# EAGLE schematic bms_master_V01 (EAGLE 7.2.0), part 2 of 2
## Sheet 9 of 9
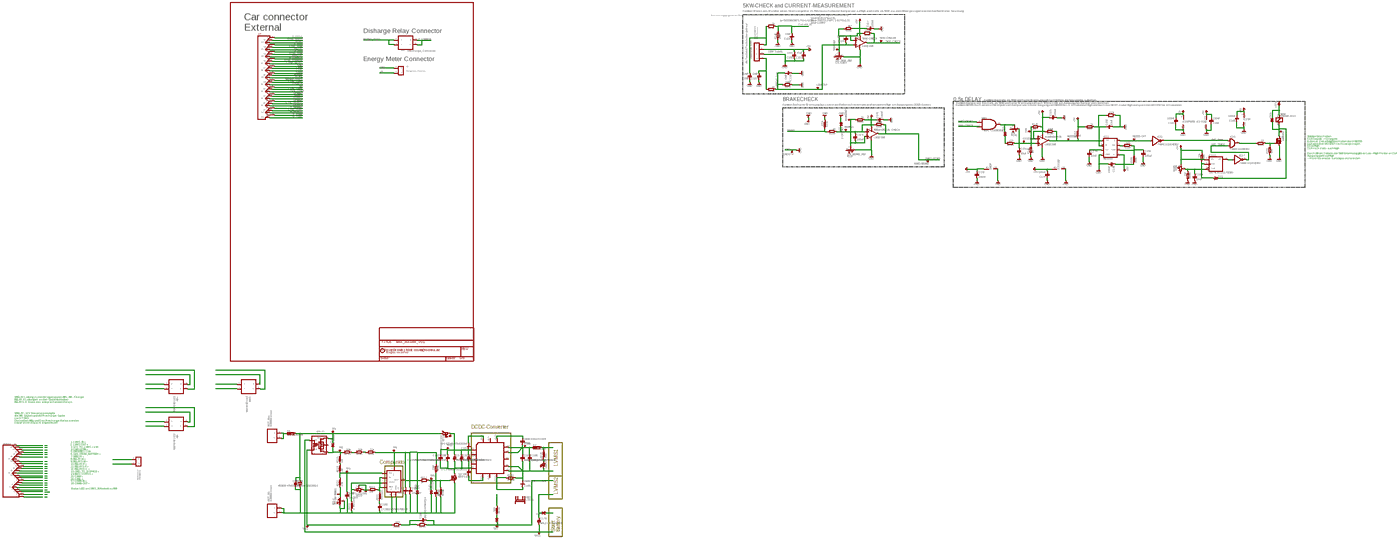
[diagram p8: schematic, sheet 9, overview]
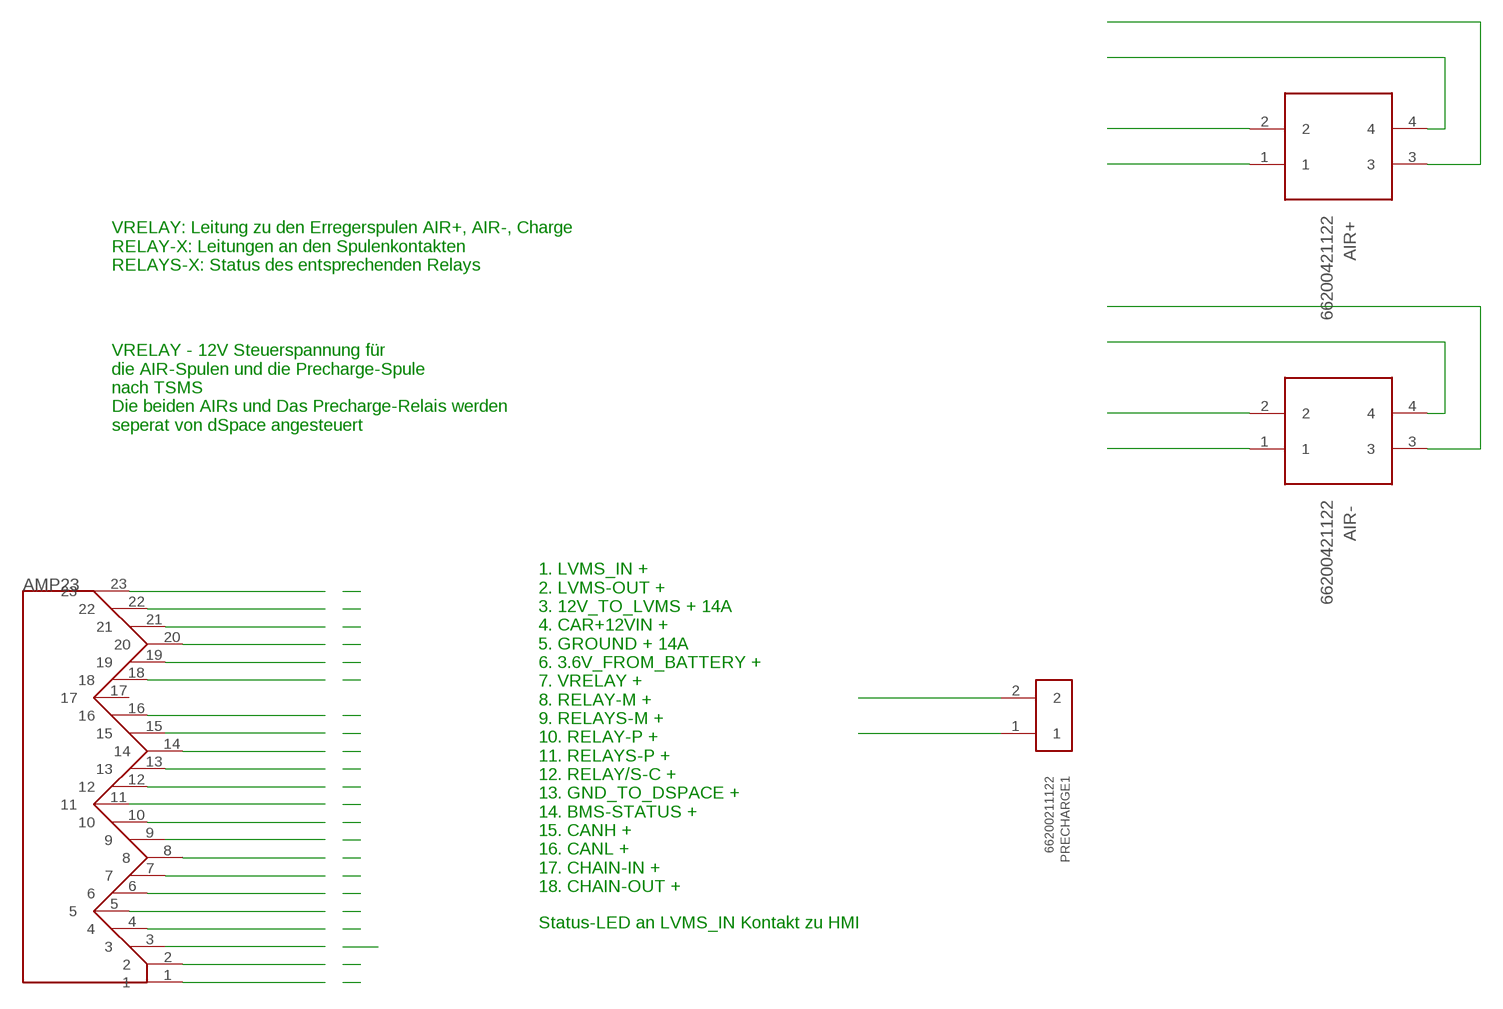
[diagram p9: schematic, sheet 9, part 1 of 5]
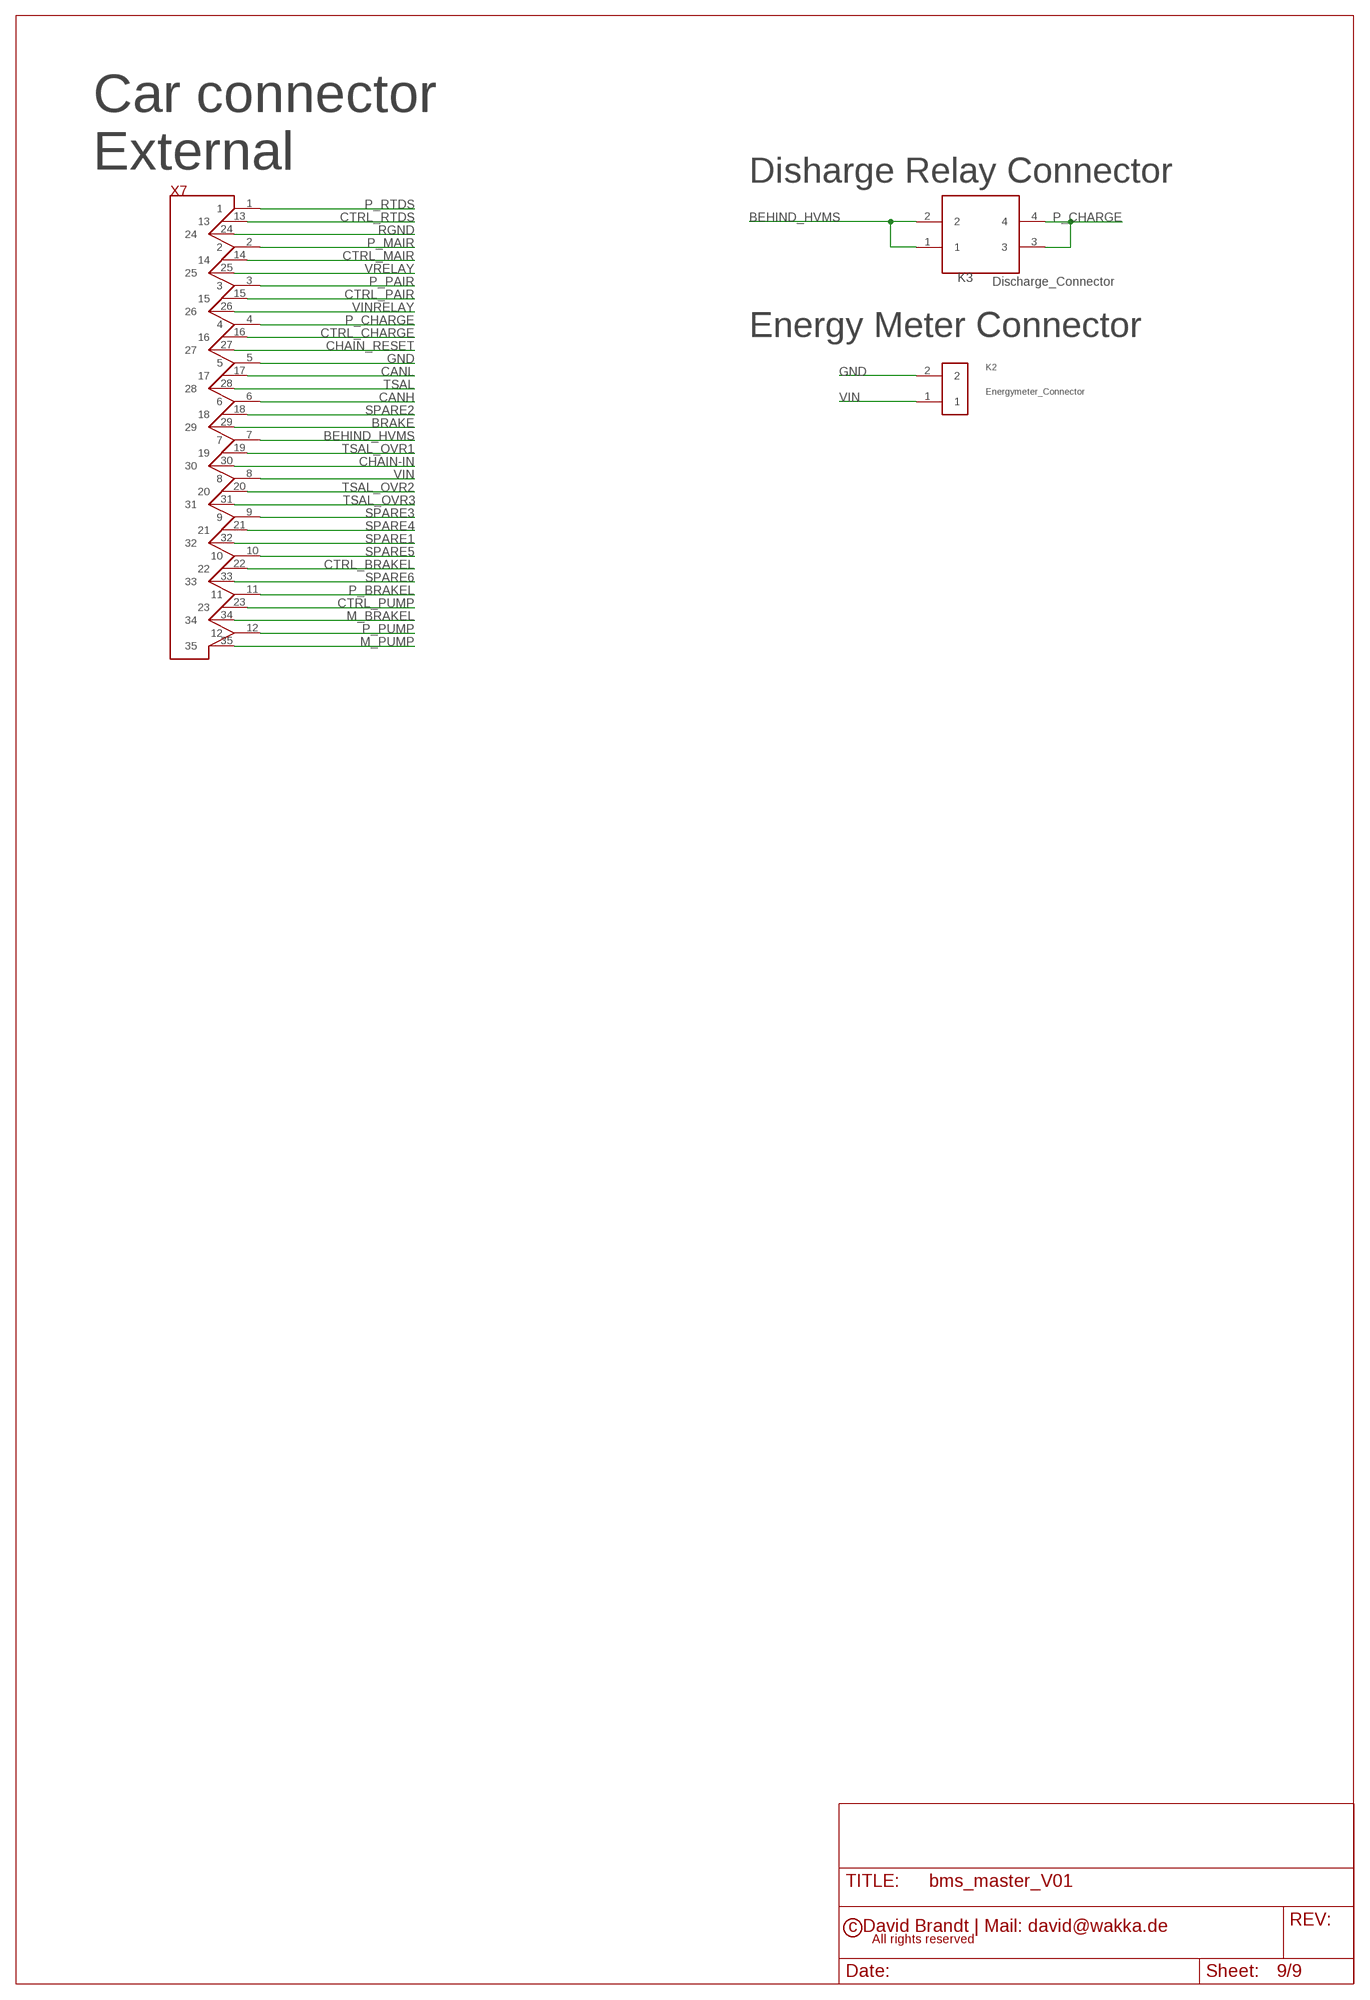
[diagram p10: schematic, sheet 9, part 2 of 5]
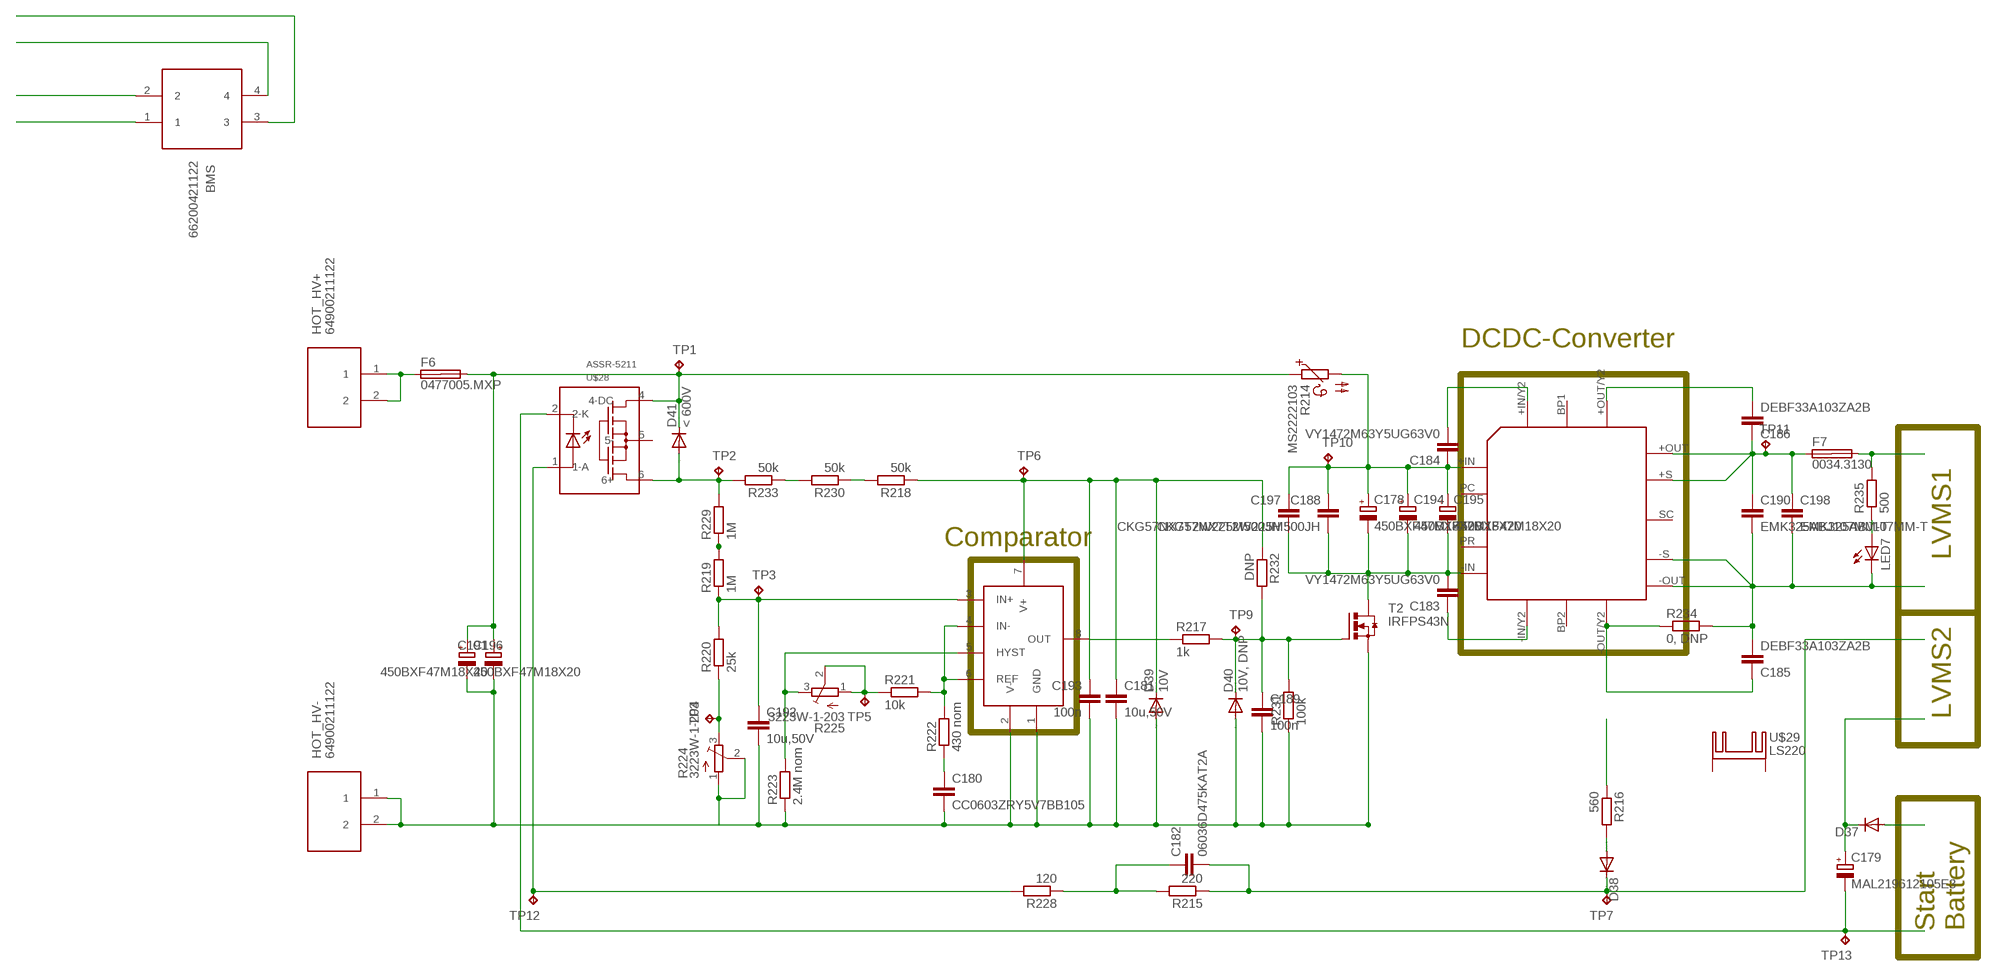
[diagram p11: schematic, sheet 9, part 3 of 5]
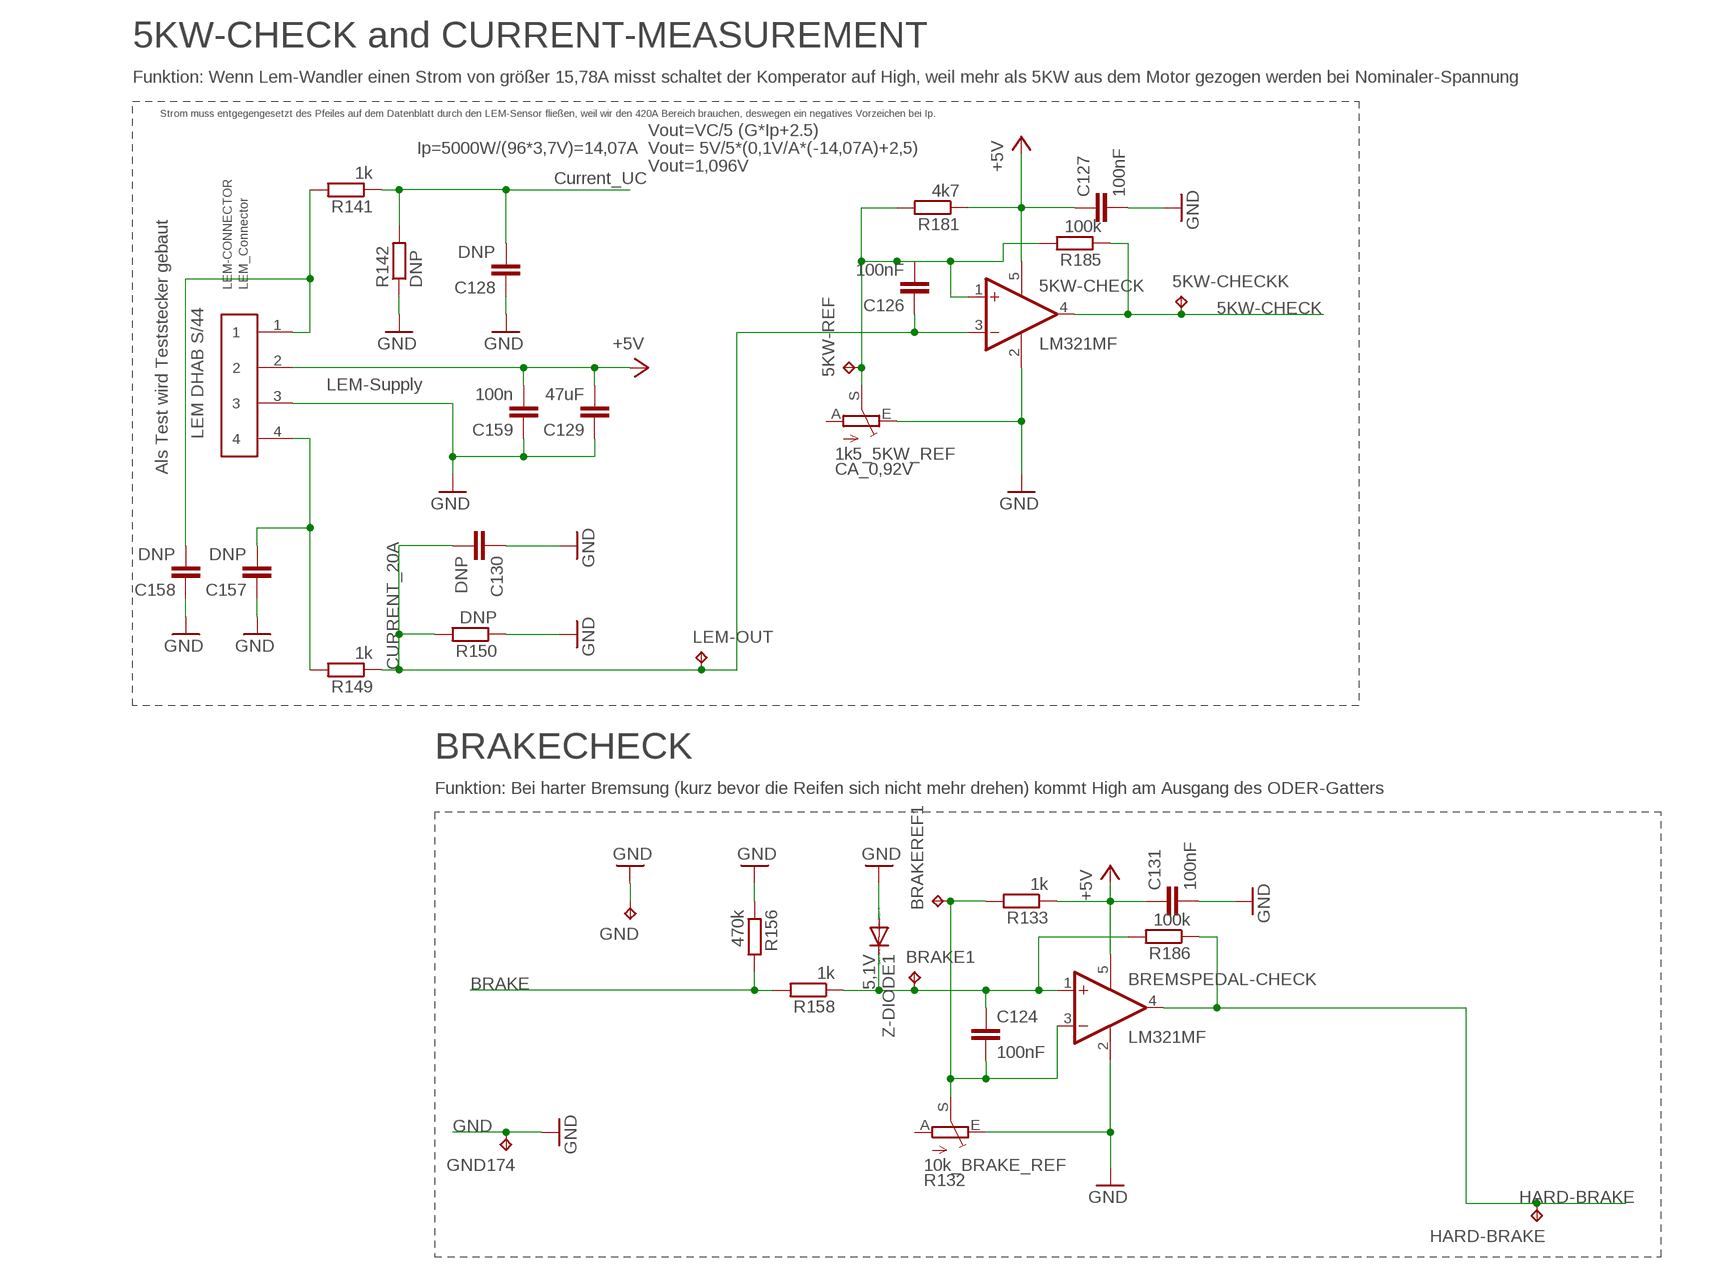
[diagram p12: schematic, sheet 9, part 4 of 5]
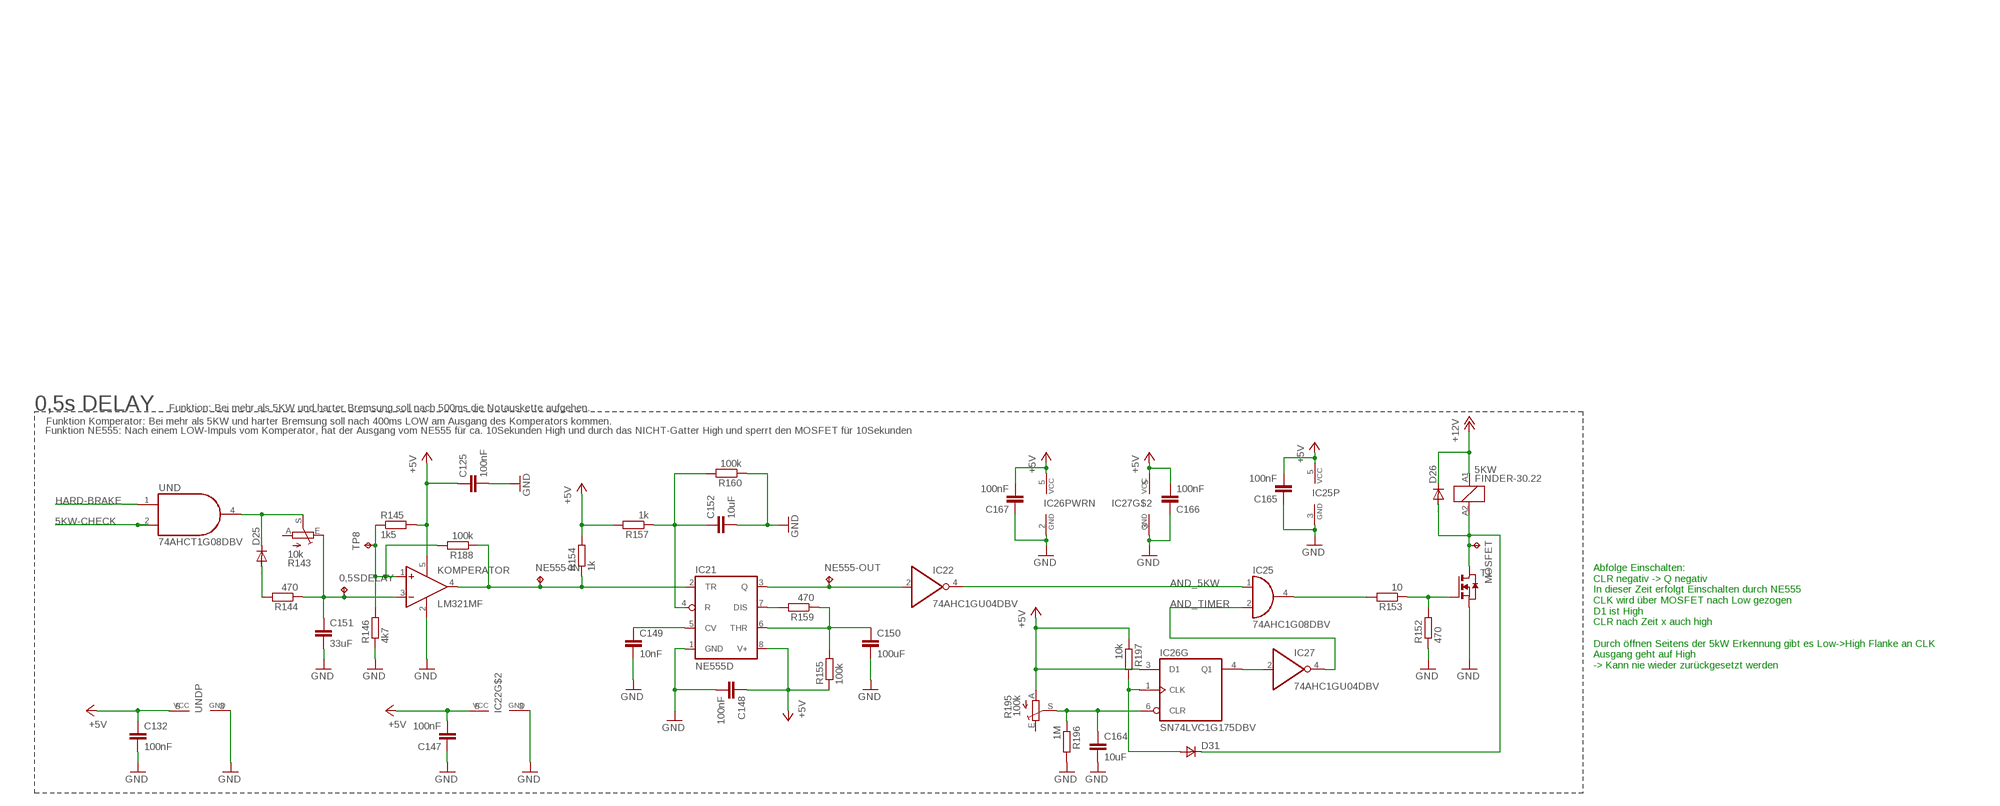
[diagram p13: schematic, sheet 9, part 5 of 5]

### Parts
0,5SDELAY  0.5s_Delay  TPB1,27  [B1,27]
5KW  FINDER-30.22  [FINDER-30.22]
5KW-CHECK  LM321MF  [SOT23-5]
5KW-CHECKK  5KW_Check  TPB1,27  [B1,27]
5KW-REF  5KW_REF  TPB1,27  [B1,27]
AIR+  66200421122  [66200421122]
AIR-  66200421122  [66200421122]
BMS  66200421122  [66200421122]
BRAKE1  BRAKE  TPB1,27  [B1,27]
BRAKEREF1  BRAKE_REF  TPB1,27  [B1,27]
BREMSPEDAL-CHECK  LM321MF  [SOT23-5]
C124  100nF  C-EUC0603  [C0603]
C125  100nF  C-EUC0603  [C0603]
C126  100nF  C-EUC0603  [C0603]
C127  100nF  C-EUC0603  [C0603]
C128  DNP  C-EUC0603  [C0603]
C129  47uF  C-EUC1206  [C1206]
C130  DNP  C-EUC0603  [C0603]
C131  100nF  C-EUC0603  [C0603]
C132  100nF  C-EUC0603  [C0603]
C147  100nF  C-EUC0603  [C0603]
C148  100nF  C-EUC0603  [C0603]
C149  10nF  C-EUC0603  [C0603]
C150  100uF  C-EUC1206K  [C1206K]
C151  33uF  C-EUC1206  [C1206]
C152  10uF  C-EUC0603  [C0603]
C157  DNP  C-EUC0603  [C0603]
C158  DNP  C-EUC0603  [C0603]
C159  100n  C-EUC0603  [C0603]
C164  10uF  C-EUC1206K  [C1206K]
C165  100nF  C-EUC0603  [C0603]
C166  100nF  C-EUC0603  [C0603]
C167  100nF  C-EUC0603  [C0603]
C178  450BXF47M18X20  CPOL-EUE7.5-18  [E7,5-18]
C179  MAL219612105E3  CPOL-EUE5-13  [E5-13]
C180  CC0603ZRY5V7BB105  C-EUC0603  [C0603]
C181  10u,50V  C-EUC1206  [C1206]
C182  06036D475KAT2A  C-EUC0603  [C0603]
C183  VY1472M63Y5UG63V0  CYYC10B5  [YC10B5]
C184  VY1472M63Y5UG63V0  CYYC10B5  [YC10B5]
C185  DEBF33A103ZA2B  C-EU050-040X10  [C050-040X10]
C186  DEBF33A103ZA2B  C-EU050-040X10  [C050-040X10]
C188  CKG57NX7T2W225M500JH  C-EUC2220K  [C2220K]
C189  100n  C-EUC1206  [C1206]
C190  EMK325ABJ107MM-T  C-EUC1210  [C1210]
C191  450BXF47M18X20  CPOL-EUE7.5-18  [E7,5-18]
C192  10u,50V  C-EUC1206  [C1206]
C193  100n  C-EUC1206  [C1206]
C194  450BXF47M18X20  CPOL-EUE7.5-18  [E7,5-18]
C195  450BXF47M18X20  CPOL-EUE7.5-18  [E7,5-18]
C196  450BXF47M18X20  CPOL-EUE7.5-18  [E7,5-18]
C197  CKG57NX7T2W225M500JH  C-EUC2220K  [C2220K]
C198  EMK325ABJ107MM-T  C-EUC1210  [C1210]
CA_0,92V  1k5_5KW_REF  TRIM_EU-S64W  [S64W]
D25  DIODE-SOD323-R  [SOD323-R]
D26  DIODE-SOD323-R  [SOD323-R]
D31  DSOD323  [SOD323]
D37  DIODE-SOD323-W  [SOD323-W]
D38  DIODE-SOD123  [SOD123]
D39  10V  DIODE-DO-214AC  [DO-214AC]
D40  10V, DNP  DIODE-DO-214AC  [DO-214AC]
D41  < 600V  DIODE-DO-214AC  [DO-214AC]
F6  0477005.MXP  SHK20L  [SHK20L]
F7  0034.3130  SHK20L  [SHK20L]
GND  GND  TPB1,27  [B1,27]
GND174  GND  TPB1,27  [B1,27]
HARD-BRAKE  HARD_BRAKE  TPB1,27  [B1,27]
HOT_HV+  64900211122  [64900211122]
HOT_HV-  64900211122  [64900211122]
IC21  NE555D  [SO08]
IC22  74AHC1GU04DBV  [SOT23-5]
IC25  74AHC1G08DBV  [SOT23-5]
IC26  SN74LVC1G175DBV  [SOT23-6]
IC27  74AHC1GU04DBV  [SOT23-5]
IC31  LTC1440  [SO08]
K2  Energymeter_Connector  66200211122  [66200211122]
K3  Discharge_Connector  66200421122  [66200421122]
KOMPERATOR  LM321MF  [SOT23-5]
LED7  LEDCHIPLED_1206  [CHIPLED_1206]
LEM-CONNECTOR  LEM_Connector  66200411122  [66200411122]
LEM-OUT  LEMC_OUT  TPB1,27  [B1,27]
MOSFET  MOSFET  TPB1,27  [B1,27]
NE555-IN  NE555_IN  TPB1,27  [B1,27]
NE555-OUT  NE555_OUT  TPB1,27  [B1,27]
PRECHARGE1  66200211122  [66200211122]
R132  10k_BRAKE_REF  TRIM_EU-S64W  [S64W]
R133  1k  R-EU_R0603  [R0603]
R141  1k  R-EU_R0603  [R0603]
R142  DNP  R-EU_R0603  [R0603]
R143  10k  TRIM_EU-S64W  [S64W]
R144  470  R-EU_R0603  [R0603]
R145  1k5  R-EU_R0603  [R0603]
R146  4k7  R-EU_R0603  [R0603]
R149  1k  R-EU_R0603  [R0603]
R150  DNP  R-EU_R0603  [R0603]
R152  470  R-EU_R0603  [R0603]
R153  10  R-EU_R0603  [R0603]
R154  1k  R-EU_R0603  [R0603]
R155  100k  R-EU_R0603  [R0603]
R156  470k  R-EU_R0603  [R0603]
R157  1k  R-EU_R0603  [R0603]
R158  1k  R-EU_R0603  [R0603]
R159  470  R-EU_R0603  [R0603]
R160  100k  R-EU_R0603  [R0603]
R181  4k7  R-EU_R0603  [R0603]
R185  100k  R-EU_R0603  [R0603]
R186  100k  R-EU_R0603  [R0603]
R188  100k  R-EU_R0603  [R0603]
R195  100k  TRIM_EU-S64W  [S64W]
R196  1M  R-EU_R0603  [R0603]
R197  10k  R-EU_R0603  [R0603]
R214  MS2222103  [MS2222103]
R215  220  R-EU_R0603  [R0603]
R216  560  R-EU_R0603  [R0603]
R217  1k  R-EU_R1206  [R1206]
R218  50k  R-EU_WSC2515  [WSC2515]
R219  1M  R-EU_WSC2515  [WSC2515]
R220  25k  R-EU_R1206  [R1206]
R221  10k  R-EU_R0603  [R0603]
R222  430 nom  R-EU_R0603  [R0603]
R223  2.4M nom  R-EU_R0603  [R0603]
R224  3223W-1-203  TRIM_EU-3223W  [3223W]
R225  3223W-1-203  TRIM_EU-3223W  [3223W]
R228  120  R-EU_R0603  [R0603]
R229  1M  R-EU_WSC2515  [WSC2515]
R230  50k  R-EU_WSC2515  [WSC2515]
R231  100k  R-EU_R1206  [R1206]
R232  DNP  R-EU_R1206  [R1206]
R233  50k  R-EU_WSC2515  [WSC2515]
R234  0, DNP  R-EU_R1210  [R1210]
R235  500  R-EU_R1206W  [R1206W]
T1  NMOSSOT23  [SOT-23]
T2  IRFPS43N  [TO247BV]
TP1  TPB2,54  [B2,54]
TP2  TPB2,54  [B2,54]
TP3  TPB2,54  [B2,54]
TP4  TPB2,54  [B2,54]
TP5  TPB2,54  [B2,54]
TP6  TPB2,54  [B2,54]
TP7  TPB2,54  [B2,54]
TP8  TPB1,27  [B1,27]
TP9  TPB2,54  [B2,54]
TP10  TPB2,54  [B2,54]
TP11  TPB2,54  [B2,54]
TP12  TPB2,54  [B2,54]
TP13  TPB2,54  [B2,54]
U$26  AMSEAL23RW  [AMPSEAL23RW]
U$27  VICORPOWER_V375B12C300BL2  [VICORPOWER_V375B12C300BL2]
U$28  ASSR-5211  [DIL06]
U$29  LS220  [LS220]
UND  74AHCT1G08DBV  [SOT23-5]
X7  AMPSEAL_35  [AMPSEAL_776231-1]
Z-DIODE1  5,1V  DIODE-SOD323-R  [SOD323-R]

### Nets
0,5SDELAY: 0,5SDELAY.TP C151.1 KOMPERATOR.3(-IN) R143.E R144.1
3.6V_FROM_BATTERY: D37.A U$26.10
5KW-CHECK: 5KW-CHECK.4(OUT) 5KW-CHECKK.TP R185.1 UND.2(I1)
5KWOP-: 5KW-CHECK.1(+IN) 5KW-REF.TP C126.2 CA_0,92V.S R181.2 R185.2
10V: C181.1 C193.1 D39.C IC31.7(V+) R218.1 R232.1 TP6.TP
12V_TO_LVMS: F7.2A R235.2 U$26.3 U$26.11 U$26.18
+5V: 5KW-CHECK.5(V+) BREMSPEDAL-CHECK.5(V+) C125.1 C127.1 C129.2 C131.1 C132.1 C147.2 C148.1 C159.2 C165.2 C166.2 C167.2 IC21.8(V+) IC22.5(VCC) IC25.5(VCC) IC26.3(G:D1) IC26.5(PWRN:VCC) IC27.5(VCC) KOMPERATOR.5(V+) LEM-CONNECTOR.2 R133.1 R145.2 R154.2 R155.1 R157.2 R181.1 R195.A R197.1 UND.5(VCC) ; also sheet 2,6,7
AND_5KW: IC22.4(O) IC25.1(I0)
AND_TIMER: IC25.2(I1) IC27.4(O)
BEHIND_HVMS: K3.1 K3.2 X7.7
BMS_STATUS: U$26.13
BRAKE: R156.2 R158.2 X7.29
BRAKE1OP+: BRAKE1.TP BREMSPEDAL-CHECK.1(+IN) C124.1 R158.1 R186.2 Z-DIODE1.C
BRAKE1OP-: BRAKEREF1.TP BREMSPEDAL-CHECK.3(-IN) C124.2 R132.S R133.2
CANH: X7.6
CANH1: BMS.1 U$26.12
CANL: X7.17
CANL1: BMS.2 U$26.4
CAR+12VIN: BMS.4 R216.1 U$26.6
CHAIN-IN: X7.30
CHAIN-IN1: U$26.7
CHAIN-OUT1: U$26.8
CHAIN_RESET: X7.27
CTRL_BRAKEL: X7.22 ; also sheet 5,8
CTRL_CHARGE: X7.16
CTRL_MAIR: X7.14
CTRL_PAIR: X7.15
CTRL_PUMP: X7.23 ; also sheet 5,8
CTRL_RTDS: X7.13 ; also sheet 5,8
CURRENT_20A: 5KW-CHECK.3(-IN) C126.1 C130.2 LEM-OUT.TP R149.1 R150.2
CURRENT_UC: C128.2 R141.1 R142.2
DCDC+: C178.+ C184.1 C188.1 C194.+ C195.+ C197.1 R214.2 TP10.TP U$27.+IN(1_+IN)
DCDC-: C178.- C183.2 C188.2 C194.- C195.- C197.2 T2.D(D1) U$27.-IN(4_-IN)
DCDCOUT+: C186.1 C190.1 C198.1 F7.1A TP11.TP U$27.+OUT(9_+OUT) U$27.+S(8_+S)
DELAYOP+: KOMPERATOR.1(+IN) R145.1 R146.2 R188.2 TP8.TP
DISCHARGE: IC21.7(DIS) R159.2
GATE: R152.2 R153.1 T1.3(G)
GATE1: C189.1 D40.C R217.2 R231.2 R232.2 T2.G(G1) TP9.TP
GND: 5KW-CHECK.2(V-) BREMSPEDAL-CHECK.2(V-) C125.2 C127.2 C128.1 C129.1 C130.1 C131.2 C132.2 C147.1 C148.2 C149.2 C150.2 C151.2 C152.2 C157.1 C158.1 C159.1 C164.2 C165.1 C166.1 C167.1 CA_0,92V.E GND174.TP GND.TP IC21.1(GND) IC22.3(GND) IC25.3(GND) IC26.2(PWRN:GND) IC27.3(GND) K2.2 KOMPERATOR.2(V-) LEM-CONNECTOR.3 R132.E R142.1 R146.1 R150.1 R152.1 R156.1 R160.1 R196.2 T1.2(S) UND.3(GND) X7.5 Z-DIODE1.A ; also sheet 2,3,4,5,6,7,8
GND_TO_DSPACE: BMS.3 U$26.5
GROUND: AIR+.3 AIR-.3 C179.- C185.2 C190.2 C198.2 LED7.C R234.2 TP13.TP U$26.1 U$26.9 U$26.16 U$27.-OUT(5_-OUT) U$27.-S(6_-S) U$28.2(2-K)
HARD-BRAKE: BREMSPEDAL-CHECK.4(OUT) HARD-BRAKE.TP R186.1 UND.1(I0)
HOT_BF_VH+: F6.1A HOT_HV+.1 HOT_HV+.2
HV+: C191.+ C196.+ D41.C F6.2A R214.1 TP1.TP U$28.4(4-DC)
HV+MR: R219.2 R229.1
HV+SW: D41.A R229.2 R233.2 TP2.TP U$28.6(6+)
HV+SW1: R230.2 R233.1
HV+SW2: R218.2 R230.1
HV-1: C180.2 C181.2 C189.2 C191.- C192.2 C193.2 C196.- D39.A D40.A HOT_HV-.1 HOT_HV-.2 IC31.1(GND) IC31.2(V-) R223.1 R224.1(A) R224.2(S) R231.1 T2.S(S1)
HYST: IC31.5(HYST) R223.2 R225.3(E)
IN+: C192.1 IC31.3(IN+) R219.1 R220.2 TP3.TP
LVMS_IN: C182.2 D38.C R215.1 TP7.TP U$26.19
LVMS_OUT: C179.+ D37.C U$26.2
M_BRAKEL: X7.34
M_PUMP: X7.35
N$69: D25.A R144.2
N$104: C157.2 LEM-CONNECTOR.4 R149.2
N$105: C158.2 LEM-CONNECTOR.1 R141.2
N$110: IC26.4(G:Q1) IC27.2(I)
N$111: D31.2(A) IC26.1(G:CLK) R197.2
N$113: D38.A R216.2
N$114: R220.1 R224.3(E) TP4.TP
N$115: C182.1 R215.2 R228.1
N$116: LED7.A R235.1
NE555-CV: C149.1 IC21.5(CV)
NE555-IN: IC21.2(TR) KOMPERATOR.4(OUT) NE555-IN.TP R154.1 R188.1
NE555-OUT: IC21.3(Q) IC22.2(I) NE555-OUT.TP
NE555-RESET: C152.1 IC21.4(R) R157.1 R160.2
NOT-OUT: IC25.4(O) R153.2
OPTOA: R228.2 TP12.TP U$28.1(1-A)
OUT: IC31.8(OUT) R217.1
P_BRAKEL: X7.11
P_CHARGE: K3.3 K3.4 X7.4
P_MAIR: X7.2
P_PAIR: X7.3
P_PUMP: X7.12
P_RTDS: X7.1
REF: IC31.4(IN-) IC31.6(REF) R221.2 R222.2
REFF: C180.1 R222.1
REFR: R221.1 R225.1(A) R225.2(S) TP5.TP
RELAY-M: AIR-.1 U$26.21
RELAY-P: AIR+.2 U$26.23
RELAY/S-C: PRECHARGE1.2 U$26.15
RELAYS-M: AIR-.4 U$26.20
RELAYS-P: AIR+.4 U$26.14
RGND: X7.24
SL: C164.1 IC26.6(G:CLR) R195.S R196.1
SNUBHV+: C184.2 U$27.+IN/Y2
SNUBHV-: C183.1 U$27.-IN/Y2
SNUBLV+: C186.2 U$27.+OUT/Y2
SNUBLV-: C185.1 R234.1 U$27.-OUT/Y2
SOURCE: 5KW.A2 D26.A D31.1(C) MOSFET.TP T1.1(D)
SPARE1: X7.32
SPARE2: X7.18
SPARE3: X7.9
SPARE4: X7.21
SPARE5: X7.10
SPARE6: X7.33
THRESHOLD: C150.1 IC21.6(THR) R155.2 R159.1
TSAL: X7.28
TSAL_OVR1: X7.19
TSAL_OVR2: X7.20
TSAL_OVR3: X7.31
UND-OUT: D25.C R143.S UND.4(O)
VIN: 5KW.A1 D26.C K2.1 X7.8 ; supply symbol labelled +12V ; also sheet 2
VINRELAY: X7.26
VRELAY: X7.25
VRELAY1: AIR+.1 AIR-.2 PRECHARGE1.1 U$26.22
Unconnected: 5KW.11(-1:P) 5KW.12(-1:O) 5KW.14(-1:S) 5KW.21(-2:P) 5KW.22(-2:O) 5KW.24(-2:S) CA_0,92V.A F6.1B F6.2B F7.1B F7.2B R132.A R143.A R195.E U$26.17 U$27.BP1 U$27.BP2 U$27.PC(2_PC) U$27.PR(3_PR) U$27.SC(7_SC) U$28.5(5-) U$29.P$1(K) U$29.P$2(K)

### Notes on the sheet
- 5KW-CHECK and CURRENT-MEASUREMENT
- Funktion: Wenn Lem-Wandler einen Strom von größer 15,78A misst schaltet der Komperator auf High, weil mehr als 5KW aus dem Motor gezogen werden bei Nominaler-Spannung
- Strom muss entgegengesetzt des Pfeiles auf dem Datenblatt durch den LEM-Sensor fließen, weil wir den 420A Bereich brauchen, deswegen ein negatives Vorzeichen bei Ip.
- Vout=VC/5 (G*Ip+2.5)
- Ip=5000W/(96*3,7V)=14,07A | Vout= 5V/5*(0,1V/A*(-14,07A)+2,5)
- Vout=1,096V
- Current_UC
- Car connector
  External
- Disharge Relay Connector
- LEM-Supply
- LEM DHAB S/44
- Energy Meter Connector
- Als Test wird Teststecker gebaut
- CURRENT_20A
- BRAKECHECK | 0,5s DELAY | Funktion: Bei mehr als 5KW und harter Bremsung soll nach 500ms die Notauskette aufgehen.
- Funktion Komperator: Bei mehr als 5KW und harter Bremsung soll nach 400ms LOW am Ausgang des Komperators kommen.
- Funktion: Bei harter Bremsung (kurz bevor die Reifen sich nicht mehr drehen) kommt High am Ausgang des ODER-Gatters | Funktion NE555: Nach einem LOW-Impuls vom Komperator, hat der Ausgang vom NE555 für ca. 10Sekunden High und durch das NICHT-Gatter High und sperrt den MOSFET für 10Sekunden
- Abfolge Einschalten:
  CLR negativ -> Q negativ
  In dieser Zeit erfolgt Einschalten durch NE555
  CLK wird über MOSFET nach Low gezogen
  D1 ist High
  CLR nach Zeit x auch high
  
  Durch öffnen Seitens der 5kW Erkennung gibt es Low->High Flanke an CLK
  Ausgang geht auf High
  -> Kann nie wieder zurückgesetzt werden
- VRELAY: Leitung zu den Erregerspulen AIR+, AIR-, Charge
  RELAY-X: Leitungen an den Spulenkontakten
  RELAYS-X: Status des entsprechenden Relays
- VRELAY - 12V Steuerspannung für 
  die AIR-Spulen und die Precharge-Spule
  nach TSMS
  Die beiden AIRs und Das Precharge-Relais werden
  seperat von dSpace angesteuert
- DCDC-Converter
- Comparator
- LVMS1
- 1. LVMS_IN +
  2. LVMS-OUT +
  3. 12V_TO_LVMS + 14A
  4. CAR+12VIN +
  5. GROUND + 14A
  6. 3.6V_FROM_BATTERY +
  7. VRELAY +
  8. RELAY-M +
  9. RELAYS-M +
  10. RELAY-P +
  11. RELAYS-P +
  12. RELAY/S-C +
  13. GND_TO_DSPACE +
  14. BMS-STATUS +
  15. CANH +
  16. CANL +
  17. CHAIN-IN +
  18. CHAIN-OUT +
- Status-LED an LVMS_IN Kontakt zu HMI
- LVMS2
- Start
  Battery

## Library data of the parts
0,5SDELAY 5KW-CHECKK 5KW-REF BRAKE1 BRAKEREF1 GND GND174 HARD-BRAKE LEM-OUT MOSFET NE555-IN NE555-OUT TP1-TP13 = testpad:TP: Test pad
5KW K_BMS K_BSPD K_IMD = relay:FINDER-30.22: SUBMINIATURE DIL-RELAIS FINDER 30.22.9.024.0000 Kontakt max. AC - 125V Distributor: Farnell Bestell Nr.: 1217371 Source: http://www.farnell.com/datasheets/87634.pdf; OC_FARNELL: unknown; OC_NEWARK: unknown
5KW-CHECK BREMSPEDAL-CHECK KOMPERATOR = linear:LM321?*: Low Power Single Op Amp Source: http://cache.national.com/ds/LM/LM321.pdf
AIR+ AIR- BMS K3 = Wuerth_Elektronik_eiCan_08_Micro_Power_Connectors:66200421122: WR-MPC3 3.00mm Male Dual Row Vertical Header, 4 Pins
B1 = microbuilder:SWITCH_TACT_SMT: SMT Tact Switches 6x6mm - Digikey: P12940SCT-ND KMR2 (4.6x2.8mm) - Digikey: 401-1426-1-ND EVQ-PQHB55 - Light Touch, 160GF (4.5x4.5mm) - Digikey: P8090SCT-ND
BAT1 = SparkFun-Electromechanical:BATTERY: Battery Holders Various common sizes : AA, AAA, 20mm coin cell and 12mm coin cell. 20MM_4LEGS, BATT-10373
C1-C40 C42-C50 C52-C80 C82-C87 C97-C102 C199-C202 C205-C229 = phrenetic:C
C41 C51 C178 C179 C191 C194-C196 C203 C204 = rcl:CPOL-EU: POLARIZED CAPACITOR, European symbol
C81 = resistor:CPOL-EU: POLARIZED CAPACITOR, European symbol
C124-C132 C147-C152 C157-C159 C164-C167 C180-C182 C185 C186 C189 C190 C192 C193 C198 = rcl:C-EU: CAPACITOR, European symbol
C183 C184 = rcl:CY: Y CAPACITOR for power line
C188 C197 = resistor:C-EU: CAPACITOR, European symbol
CA_0,92V R132 R143 R195 R224 R225 R273 = pot:TRIM_EU-: POTENTIOMETER
CN1 = phrenetic:MICROSD: MicroSD/Transflash Card Holder with SPI pinout 3M: 2908-05WB-MG 4UConnector: 19656 Footprint courtesy: Adafruit Industries
D1 D20-D22 D52 D60 D61 D64 D65 = phrenetic:DIODE-: DIODE
D2 D4-D9 D19 D23 D43-D51 D53-D58 D62 D63 = phrenetic:ZENER
D25 D26 D37-D41 DIN Z-DIODE1 = diode:DIODE-: DIODE
D31 = zetex:D: DIODE; MPN: CDSOD323-T05C; OC_FARNELL: 1824860; OC_NEWARK: 79R6078
DCDC1 DCDC2 = phrenetic:DCDC_ISO
F1-F4 F8-F14 = phrenetic:FUSE
F6 F7 = fuse:SHK20L: FUSE HOLDER 5 x 20 mm, SH contact, SHH1 Schukat, E1073 Buerklin; OC_FARNELL: unknown; OC_NEWARK: unknown
FID1-FID11 = microbuilder:FIDUCIAL: Fiducial Alignment Points Various fiducial points for machine vision alignment.
HOT_HV+ HOT_HV- = Wuerth_Elektronik_eiCan_07_Mini_Power_Connectors:64900211122: WR-MPC4 4.20mm Male Single Row Vertical Header, 2 Pins
IC1 IC7 IC8 = phrenetic:SN65HVDA540
IC2 IC12 IC13 = microbuilder:TEMP_LM75B: LM75B I2C Temperature Sensor The I2C-based LM75B can measure temperature between -55 and 125°C in 0.125°C increments (11-bit resolution). Digikey: 568-4768-1-ND For a 1.8V compatible part, look at the following pin and SW compatible parts: DS75LV - Mouser: 700-DS75LVS, Digikey: (TSSOP8) DS75LVU+-ND (SOIC8) DS75LVS+-ND
IC3 = phrenetic:MPU9250
IC4 = TMS570:TPS65381-Q1
IC5 IC45 = linear:TL331: SINGLE DIFFERENTIAL COMPARATOR Source: Data sheet <http://www.ti.com/lit/ds/symlink/tl331-q1.pdf>
IC6 = TMS570:PCA2129T
IC9 = linear:LM2902: Low power quad operational amplifier Source: Data sgeet <http://www.st.com/internet/com/TECHNICAL_RESOURCES/TECHNICAL_LITERATURE/DATASHEET/CD00000533.pdf>
IC10 IC39 IC41 IC49 IC54 = 74xx-little-de:74*1G04: INVERTER Gate
IC11 = TMS570:TMS570LS3137ZWT
IC16 IC21 IC46 = linear:*555: TIMER
IC17 IC44 = 74xx-little-de:74*1G02: 2-input NOR gate
IC18 = 74xx-eu:74*125: Quad bus BUFFER, 3-state
IC22 IC27 = 74xx-little-de:74*1GU04: Single Unbuffered Inverter
IC25 IC42 IC47 IC48 IC50-IC53 = 74xx-little-de:74*1G08: 2-input AND gate
IC26 = phrenetic:SN74LVC1G175
IC31 = LTC1140:LTC1440
IC32-IC35 = phrenetic:UCC27XXX-Q1
IC36 IC37 IC40 IC43 = 74xx-little-de:74*1G32: 2-input OR gate
IC38 = 74xx-little-de:74*1G79: Single Positive-Edge-Triggered D-Type Flip-Flop Source: Data sheet <http://www.ti.com/lit/ds/symlink/sn74lvc1g79.pdf>
IC123 = phrenetic:VIPER16
JTAG1 = phrenetic:JTAG20
K2 PRECHARGE1 = Wuerth_Elektronik_eiCan_08_Micro_Power_Connectors:66200211122: WR-MPC3 3.00mm Male Single Row Vertical Header, 2 Pins
L1 L7 = EagleLibrary_Wuerth_Elektronik_eiSos_Version_6:WE-PMI: Power Multilayer Inductor WE-PMI - Compact multilayer type - Suitable for applocations with high currents up to 2.5 A - No crosstalk -- DC / DC converters especially at high switching frequencies -- Portable devices like PDA and digital cameras
L2 = SignalCommunications:WE-PD2: SMD-Power Inductors WE-PD2 - Industry standard size - Current capability up to 14 A -- Switching regulators with low operating voltages (computer, laptop, mobile phones, pagers) -- Integrated DC/DC-converter -- Is recommended for the application with switching regulators from National Semiconductor, Linear Technology, Texas Instruments and Fairchild Semiconductor -- Perfectly suitable for switching regulators with extremely high efficiency
L3 = SignalCommunications:WE-PD2_HV: SMD-Power Inductors WE-PD2 HV - Unshielde construction - Designed for 400VDC -- Non-isolated buck or buck-boost converter like Power Integrations LinkSwitch-TN -- Constant current LED driver -- Utility metering -- Filter for power supply; COMPANY-URL: http://we-online.de; CREATED-BY: Christin Otto; CREATED-DATE: August 2013; DATASHEET-URL: http://katalog.we-online.de/de/pbs/WE-PD2_HV?sid=27407868f1#vs_ct:1; MANUFACTURER: Würth Elektronik eiSos GmbH
L4 = PowerMagnetics:WE-CBF: SMD EMI Suppression Ferrite Beads WE-CBF - Excellent anti-EMI properties - Low DC-restistance - Impedances till 3000 ohms - Rated current up to 6 A -- Reliable Ni-Sn electrodes -- Perfect as data lined filter and for uncoupling of distribution voltage <http://katalog.we-online.de/media/images/eisos/FeCBF_pf2.jpg> Details see: http://katalog.we-online.de/en/pbs/WE-CBF updated by Dan Xu 2014-06-19 2014 (C) Würth Elektronik
LED1 LED3 LED5 = phrenetic:LED
LED7 = led:LED: LED OSRAM: - CHIPLED LG R971, LG N971, LY N971, LG Q971, LY Q971, LO R971, LY R971 LH N974, LH R974 LS Q976, LO Q976, LY Q976 LO Q996 - Hyper CHIPLED LW Q18S LB Q993, LB Q99A, LB R99A - SideLED LS A670, LO A670, LY A670, LG A670, LP A670 LB A673, LV A673, LT A673, LW A673 LH A674 LY A675 LS A676, LA A676, LO A676, LY A676, LW A676 LS A679, LY A679, LG A679 - Hyper Micro SIDELED® LS Y876, LA Y876, LO Y876, LY Y876 LT Y87S - SmartLED LW L88C, LW L88S LB L89C, LB L89S, LG L890 LS L89K, LO L89K, LY L89K LS L896, LA L896, LO L896, LY L896 - TOPLED LS T670, LO T670, LY T670, LG T670, LP T670 LSG T670, LSP T670, LSY T670, LOP T670, LYG T670 LG T671, LOG T671, LSG T671 LB T673, LV T673, LT T673, LW T673 LH T674 LS T676, LA T676, LO T676, LY T676, LB T676, LH T676, LSB T676, LW T676 LB T67C, LV T67C, LT T67C, LS T67K, LO T67K, LY T67K, LW E67C LS E67B, LA E67B, LO E67B, LY E67B, LB E67C, LV E67C, LT E67C LW T67C LS T679, LY T679, LG T679 LS T770, LO T770, LY T770, LG T770, LP T770 LB T773, LV T773, LT T773, LW T773 LH T774 LS E675, LA E675, LY E675, LS T675 LS T776, LA T776, LO T776, LY T776, LB T776 LHGB T686 LT T68C, LB T68C - Hyper Mini TOPLED® LB M676 - Mini TOPLED Santana® LG M470 LS M47K, LO M47K, LY M47K Source: http://www.osram.convergy.de LUXEON: - LUMILED® LXK2-PW12-R00, LXK2-PW12-S00, LXK2-PW14-U00, LXK2-PW14-V00 LXK2-PM12-R00, LXK2-PM12-S00, LXK2-PM14-U00 LXK2-PE12-Q00, LXK2-PE12-R00, LXK2-PE12-S00, LXK2-PE14-T00, LXK2-PE14-U00 LXK2-PB12-K00, LXK2-PB12-L00, LXK2-PB12-M00, LXK2-PB14-N00, LXK2-PB14-P00, LXK2-PB14-Q00 LXK2-PR12-L00, LXK2-PR12-M00, LXK2-PR14-Q00, LXK2-PR14-R00 LXK2-PD12-Q00, LXK2-PD12-R00, LXK2-PD12-S00 LXK2-PH12-R00, LXK2-PH12-S00 LXK2-PL12-P00, LXK2-PL12-Q00, LXK2-PL12-R00 Source: www.luxeon.com KINGBRIGHT: KA-3528ASYC Source: www.kingbright.com
LEM-CONNECTOR = Wuerth_Elektronik_eiCan_08_Micro_Power_Connectors:66200411122: WR-MPC3 3.00mm Male Single Row Vertical Header, 4 Pins
OC1 = phrenetic:ACPL-K7X
PTC1 PTC2 = phrenetic:PTC: PTC (Resettable Fuse) 1206 Package 250mA PTC (16V Max, Time-to-Trip: 0.08s) - Digikey: F2110CT-ND 1210 Package 100mA PTC (30V Max, Time-to-Trip: 0.6s) - Digikey: MF-USMF010-2CT-ND 1812 Package 750mA PTC (24V Max, Time-to-Trip: 0.2s) - Digikey: MF-MSMF075/24-2CT-ND
Q1 = phrenetic:CRYSTAL4
Q2 Q23-Q30 = phrenetic:NMOSFET
Q3 = SparkFun-DiscreteSemi:MOSFET-NCHANNEL: Common NMOSFET Parts MFG P/N Store ID Prod ID FDD8780 TRANS-09984 SI7820DN TRANS-11055 FDS6630A IC-08089 2N7002PW TRANS-11151 FQP30N06L COM-10213 TRANS-10060 BSS123LT1G TRANS-08345 BSS138 TRANS-00830 BS170 2N7000; PROD_ID: TRANS-09984
Q4 = phrenetic:BSS84
Q5 Q31-Q33 Q35 = phrenetic:2N7002
Q34 = phrenetic:PMOSFET
R1-R77 R80 R83 R84 R86 R88-R93 R105 R236-R262 R264-R272 R274-R283 = phrenetic:R: RESISTOR, Bla
R85 R87 = rcl:R-TRIMM: Trimm resistor
R133 R141 R142 R144-R146 R149 R150 R152-R160 R181 R185 R186 R188 R196 R197 R215 R216 R228 = resistor:R-EU_: RESISTOR, European symbol
R214 = ptc-ntc:MS2222103
R217-R223 R229-R235 = rcl:R-EU_: RESISTOR, European symbol
T1 = zetex:NMOSSOT23: MOS FET; OC_FARNELL: unknown; OC_NEWARK: unknown
T2 = vishay:IRFPS43N: Super TO247; VISHAY N-Channel Power MOSFET
U3 = pinhead-2:MAX232: RS232 Transceiver Very common IC. This is generically called 'MAX232', but works with the 3V equivalent MAX3232 generic ICs. Field tested and mother approved. Spark Fun Electronics SKU : COM-00316 (DIP) and COM-00589 (SMD)
U$3 U$23 = bms-hsrm:LT6656
U$19 = bms-hsrm:ADUM1201
U$20 = bms-hsrm:LTC1864
U$22 = bms-hsrm:ADUM1301
U$26 = AMPSEAL23RW:AMSEAL23RW
U$27 = dc-dc-converter-vicor:VICORPOWER_V375B12C300BL2
U$28 = optocoupler:ASSR-5211
U$29 = heatsink:LS220
UND = 74xx-little-us:74*1G08: 2-input AND gate
X1 X7 = phrenetic:AMPSEAL_35
X2 X3 X5 X6 X8 = con-molex-micro-fit-3_0:HEADER_POS2_?: Molex - Micro-Fit 3.0 Series connector, 3.00mm (0.118") pitch header, 2 positions.
X4 = con-molex-micro-fit-3_0:HEADER_POS4_?: Molex - Micro-Fit 3.0 Series connector, 3.00mm (0.118") pitch header, 4 positions.
X9 = con-molex-micro-fit-3_0:HEADER_POS8_?: Molex - Micro-Fit 3.0 Series connector, 3.00mm (0.118") pitch header, 8 positions.